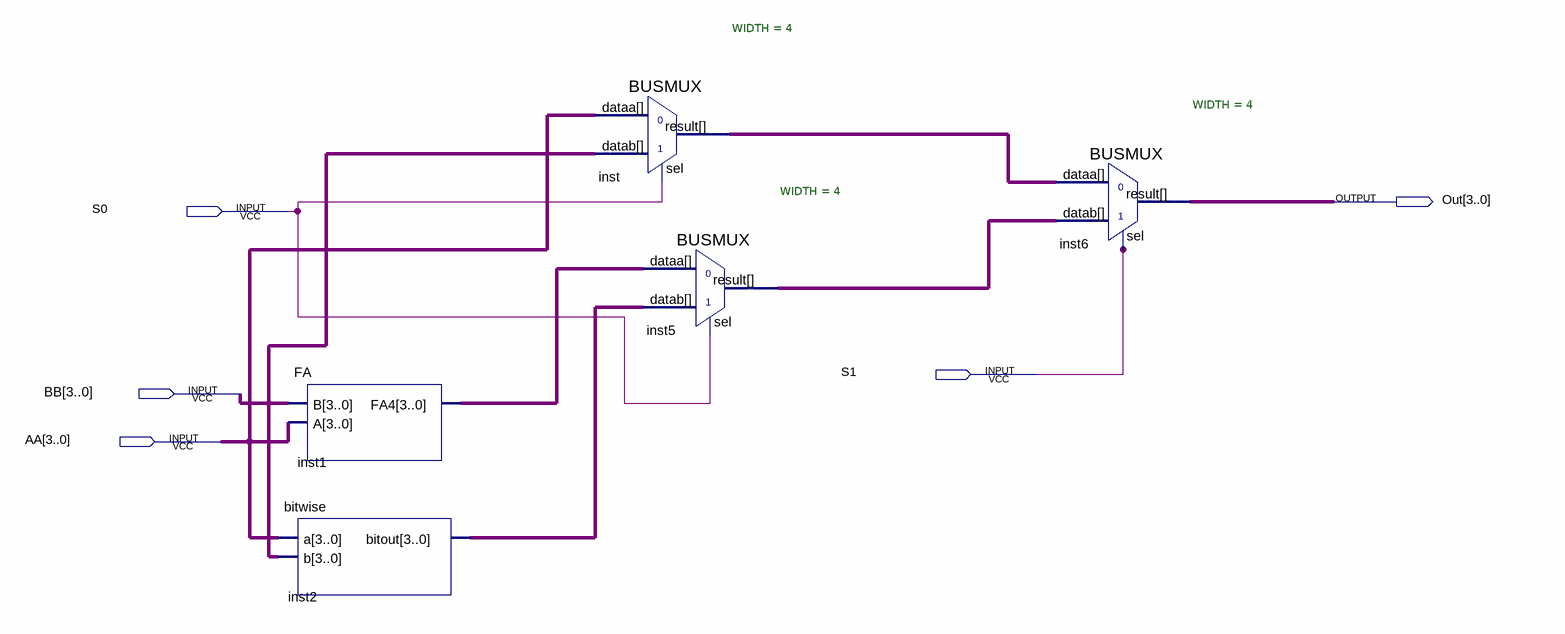
[diagram p0: schematic sheet]
// Quartus schematic Integration.bdf as structural Verilog: 5 symbols, 5 pins
module Integration (
  input  S0,
  input  S1,
  input  [3:0] BB,
  input  [3:0] AA,
  output [3:0] Out
);

  wire [3:0] inst1_fa4, inst2_bitout, inst5_result, inst_result;

  FA inst1 (.B(BB), .A(AA), .FA4(inst1_fa4));
  bitwise inst2 (.a(AA), .b(BB), .bitout(inst2_bitout));
  BUSMUX #(.WIDTH(4)) inst (.datab(BB), .sel(S0), .dataa(AA), .result(inst_result));
  BUSMUX #(.WIDTH(4)) inst5 (.datab(inst2_bitout), .sel(S0), .dataa(inst1_fa4), .result(inst5_result));
  BUSMUX #(.WIDTH(4)) inst6 (.datab(inst5_result), .sel(S1), .dataa(inst_result), .result(Out));
endmodule
